# Altium schematic sheet POWER+HALL.SchDoc (part 3 of 3)
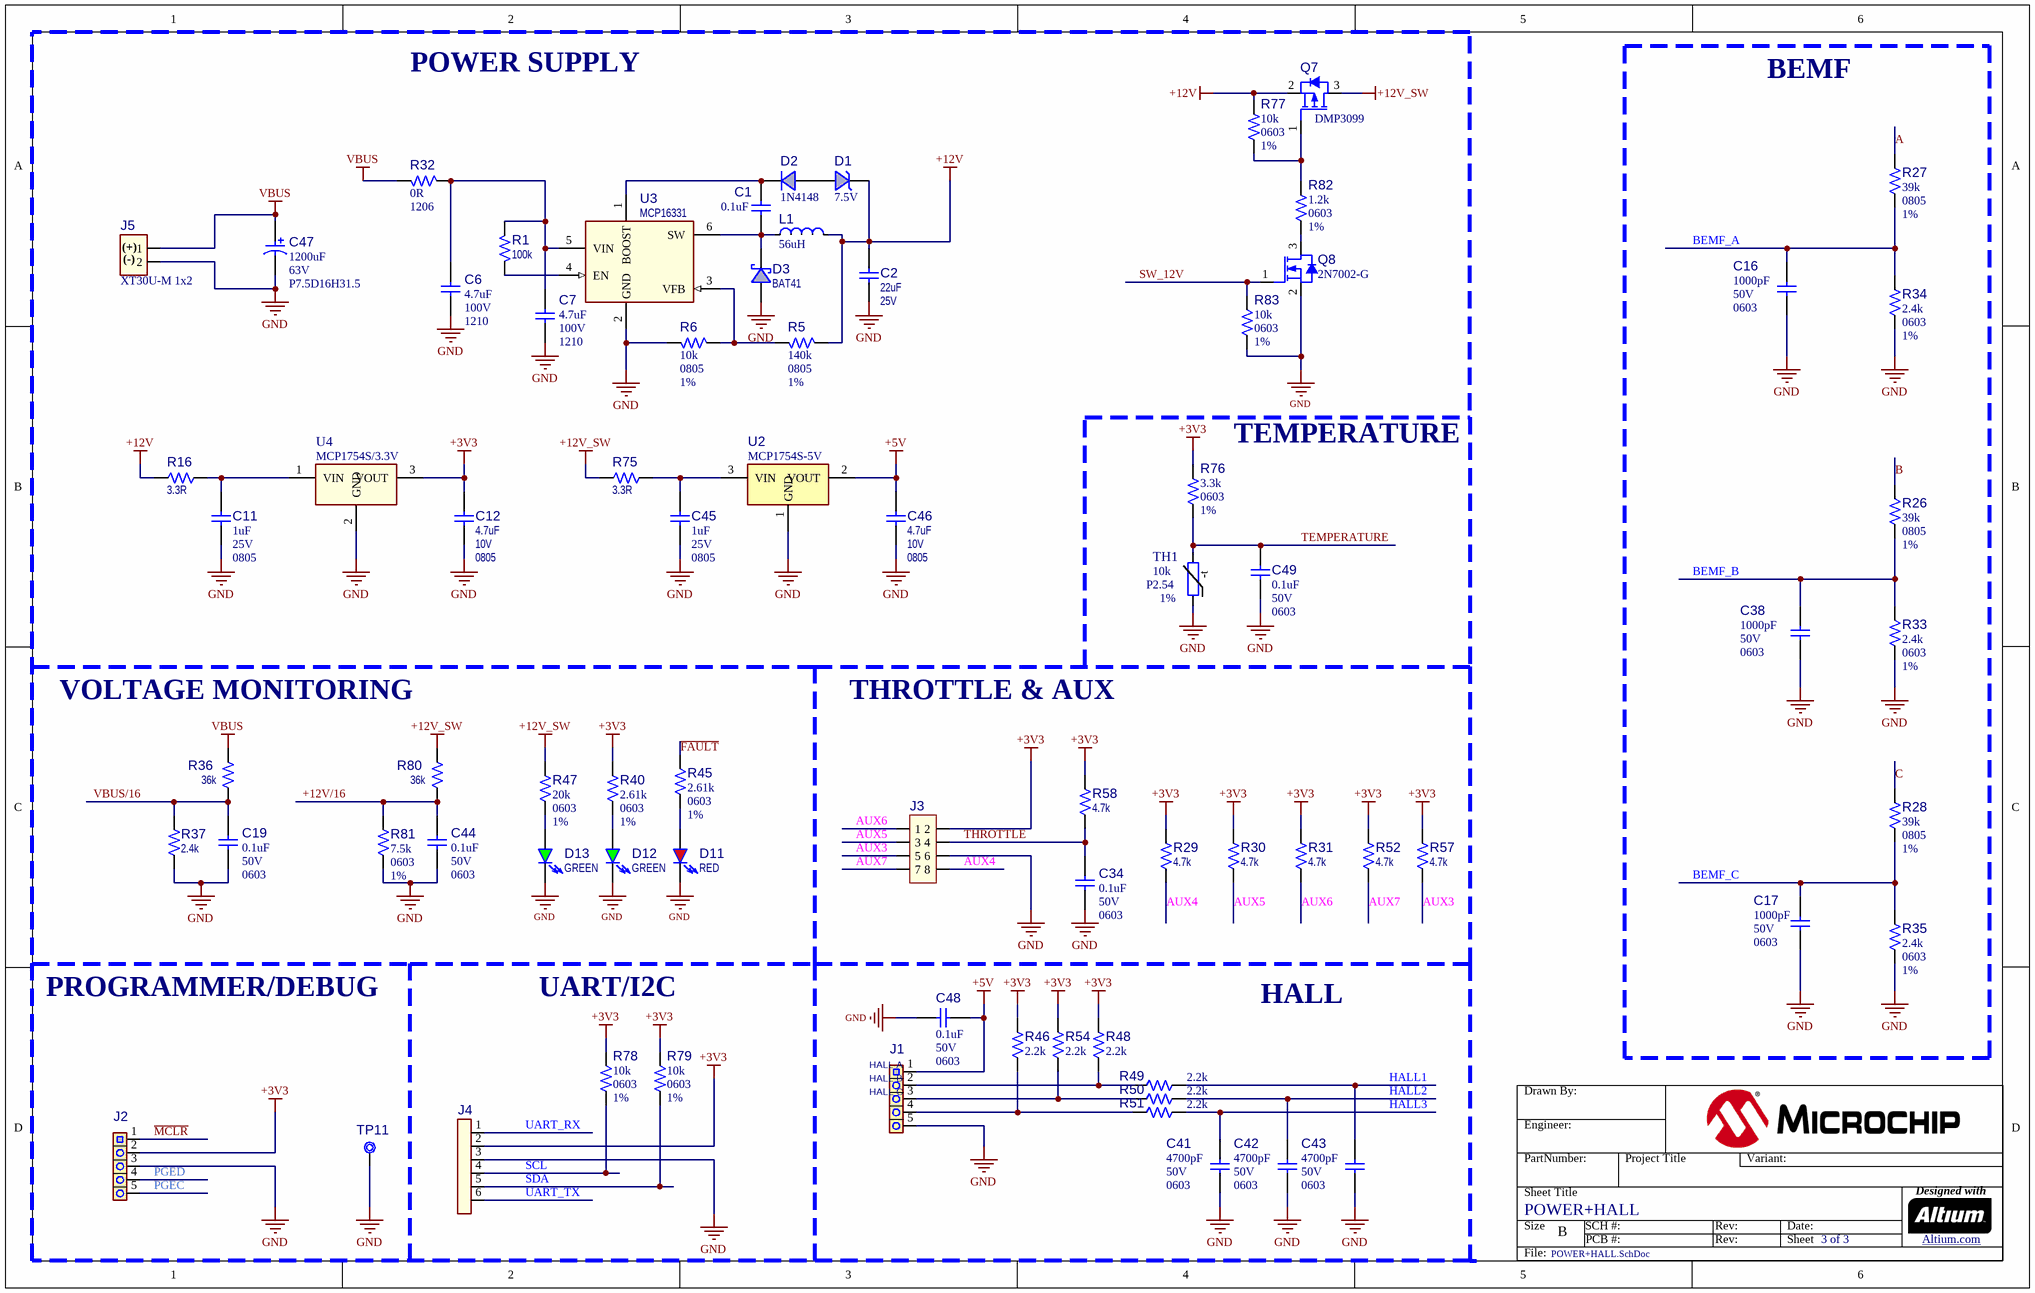
[diagram p2: POWER+HALL.SchDoc]

## Library data of the parts (continued)
R82 = RSMT1022: Manufacturer 1: Stackpole Electronics Inc; Manufacturer Part Number 1: RMCF0603FT1K20; Description_: RES TKF 1.2k 1% 1/10W SMD 0603; Dev Tools Status: Production; Voltage: 50V; Temperature Coeffcient: 100ppm/C; Current: 1A; Power: 1/10W; Owner: Aaron VanDuerm; Populated: Yes; MCHP-ID: RSMT1022; Revision: 1; Symbol: Resistor; Status: MCL Design; ComponentLink1URL: https://chn-vm-apps.microchip.com/mchprepo/parts/Datasheets/SEI-RMCF_RMCP.pdf; ComponentLink1Description: SVN Datasheet; ComponentLink2URL: C:\ALTIUM_WORK\00001_MCHP-CDB\Datasheets\SEI-RMCF_RMCP.pdf; ComponentLink2Description: Local Datasheet; ComponentLink3URL: C:\ALTIUM_WORK\00001_MCHP-CDB\Library\LibraryRefs\Resistor.SchLib; ComponentLink3Description: Open Symbol; ComponentLink4URL: C:\ALTIUM_WORK\00001_MCHP-CDB\Library\Footprints\RES_C_0603.PcbLib; ComponentLink4Description: Open Footprint; ComponentLink5Description: Open Footprint 2; ComponentLink6Description: Open Footprint 3; ComponentLink7Description: Open Footprint 4; Operating Temperature: -55C to +155C; Category: Resistor; Type: RES SMD; Composition: TKF; Supplier 1: Digi-Key; Supplier Part Number 1: RMCF0603FT1K20CT-ND; Quantity Override: 1
TH1 = RES2734: Manufacturer 1: EPCOS - TDK Electronics; Manufacturer Part Number 1: B57861S0103F040; Description_: RES THERMISTOR NTC RADIAL 10k TH P2.54mm 3988K BEAD; Dev Tools Status: Design; Power: 60mW; Owner: Octavian Stroe; Populated: YES; MCHP-ID: RES2734; Revision: 2; Symbol: Thermistor NTC; Status: MCL Design; ComponentLink1URL: https://chn-vm-apps.microchip.com/mchprepo/parts/Datasheets/NTC_Mini_sensors_S861.pdf; ComponentLink1Description: SVN Datasheet; ComponentLink2URL: C:\ALTIUM_WORK\00001_MCHP-CDB\Datasheets\NTC_Mini_sensors_S861.pdf; ComponentLink2Description: Local Datasheet; ComponentLink3URL: C:\ALTIUM_WORK\00001_MCHP-CDB\Library\LibraryRefs\Thermistor NTC.SchLib; ComponentLink3Description: Open Symbol; ComponentLink4URL: C:\ALTIUM_WORK\00001_MCHP-CDB\Library\Footprints\Thermistor_Wired_P2.54.PcbLib; ComponentLink4Description: Open Footprint; ComponentLink5Description: Open Footprint 2; ComponentLink6Description: Open Footprint 3; ComponentLink7Description: Open Footprint 4; Operating Temperature: -55C to +155C; Category: Resistor; Type: Thermistor; Supplier 1: Digi-Key; Supplier Part Number 1: 495-2142-ND; Quantity Override: 1; ComponentLink7URL: C:\ALTIUM_WORK\00001_MCHP-CDB\Library\Footprints\Thermistor_Wired_P1.5.PcbLib
TP11 = CON1747: Test Point; Description_: CON TP PAD PCB 3.4x5 SMD; Dev Tools Status: Design; Owner: Gabor Bihari; Populated: YES; MCHP-ID: CON1747; Revision: A; Symbol: Test Point No BOM; Status: MCL Design; ComponentLink1Description: SVN Datasheet; ComponentLink2Description: Local Datasheet; ComponentLink3URL: C:\ALTIUM_WORK\00001_MCHP-CDB\Library\LibraryRefs\Test Point No BOM.SchLib; ComponentLink3Description: Open Symbol; ComponentLink4URL: C:\ALTIUM_WORK\00001_MCHP-CDB\Library\Footprints\TP_3.4x5_SMD_NOBOM.PcbLib; ComponentLink4Description: Open Footprint; ComponentLink5Description: Open Footprint 2; ComponentLink6Description: Open Footprint 3; ComponentLink7Description: Open Footprint 4; Type: Test Point; Category: Connector; Quantity Override: 1
U2 = MIC9094: LDO; Manufacturer 1: Microchip Technology Inc; Manufacturer Part Number 1: MCP1754S-5002E/CB; Description_: MCHP ANALOG LDO 5V MCP1754S-5002E/CB SOT-23A-3; Dev Tools Status: Design; Owner: Octavian Stroe; Populated: YES; MCHP-ID: MIC9094; Symbol: MCP1754ST-5002ECB SOT-23A-3; Type: LDO; Status: MCL Design; Revision: 1; Category: MCHP-Analog; ComponentLink1Description: SVN Datasheet; ComponentLink2Description: Local Datasheet; ComponentLink3URL: C:\ALTIUM_WORK\00001_MCHP-CDB\Library\LibraryRefs\MCP1754ST-5002ECB SOT-23A-3.SchLib; ComponentLink3Description: Open Symbol; ComponentLink4URL: C:\ALTIUM_WORK\00001_MCHP-CDB\Library\Footprints\SOT-23A-3.PcbLib; ComponentLink4Description: Open Footprint; ComponentLink5Description: Open Footprint 2; ComponentLink6Description: Open Footprint 3; ComponentLink7Description: Open Footprint 4; Supplier 1: Microchip Technology Inc; Supplier Part Number 1: MCP1754S-5002E/CB; Quantity Override: 1
U3 = MIC6150: DC-DC Convertor; Manufacturer 1: Microchip Technology; Manufacturer Part Number 1: MCP16331T-E/CH; Description_: MCHP ANALOG SWITCHER Buck 2 to 24V MCP16331T-E/CH SOT-23-6; Dev Tools Status: Production; Owner: Bogdan Popescu; Populated: YES; MCHP-ID: MIC6150; Symbol: MCP16331 SOT-23-6; Type: Switcher; Status: MCL Design; Revision: 1; Category: MCHP-Analog; ComponentLink1Description: SVN Datasheet; ComponentLink2Description: Local Datasheet; ComponentLink3URL: C:\ALTIUM_WORK\00001_MCHP-CDB\Library\LibraryRefs\MCP16331 SOT-23-6.SchLib; ComponentLink3Description: Open Symbol; ComponentLink4URL: C:\ALTIUM_WORK\00001_MCHP-CDB\Library\Footprints\SOT-23-6.PcbLib; ComponentLink4Description: Open Footprint; ComponentLink5Description: Open Footprint 2; ComponentLink6Description: Open Footprint 3; ComponentLink7Description: Open Footprint 4; Supplier 1: Microchip Technology; Supplier Part Number 1: MCP16331T-E/CH; Quantity Override: 1
U4 = MIC5958: LDO; Manufacturer 1: Microchip; Manufacturer Part Number 1: MCP1754ST-3302E/DB; Description_: MCHP ANALOG LDO 3.3V MCP1754ST-3302E/DB SOT-223-3; MAPS Description: 16V, High PSRR, 150mA LDO, Vout=3.3V; Dev Tools Status: Production; Owner: Tad Ahlvers; MPC: V0AB2YF6XB00; LeadContent: Pb-FREE; PackingMedia: T/R; Stage: REL; LeadCount: 3; ForceMinOrderQtyMult: True; MinOrderQty: 1; TempRange: -40C to +125C; tblDeviceFamilyID: 3163; Populated: YES; MCHP-ID: MIC5958; Symbol: MCP1754S SOT-89-3_SOT-223-3; Type: LDO; Status: MCL Design; Revision: 1; Category: MCHP-Analog; ComponentLink1URL: http://www.microchip.com/wwwproducts/MCP1754S; ComponentLink1Description: SVN Datasheet; ComponentLink2Description: Local Datasheet; ComponentLink3URL: C:\ALTIUM_WORK\00001_MCHP-CDB\Library\LibraryRefs\MCP1754S SOT-89-3_SOT-223-3.SchLib; ComponentLink3Description: Open Symbol; ComponentLink4URL: C:\ALTIUM_WORK\00001_MCHP-CDB\Library\Footprints\SOT-223-3.PcbLib; ComponentLink4Description: Open Footprint; ComponentLink5Description: Open Footprint 2; ComponentLink6Description: Open Footprint 3; ComponentLink7Description: Open Footprint 4; Supplier 1: Microchip; Supplier Part Number 1: MCP1754ST-3302E/DB; IntroductionDate: 2011-08-16; PackageType: SOT-223; Quantity Override: 1